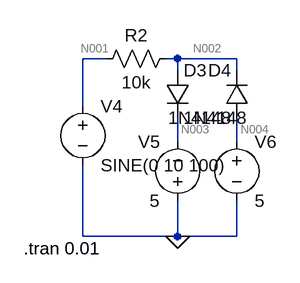
[diagram p0: schematic Draft5.asc]
Draft5.asc, the LTspice schematic file:
Version 4.1
SHEET 1 880 680
WIRE 272 32 240 32
WIRE 368 32 352 32
WIRE 448 32 368 32
WIRE 368 48 368 32
WIRE 448 48 448 32
WIRE 240 96 240 32
WIRE 368 144 368 112
WIRE 448 144 448 112
WIRE 240 272 240 176
WIRE 368 272 368 224
WIRE 368 272 240 272
WIRE 448 272 448 224
WIRE 448 272 368 272
FLAG 368 272 0
SYMBOL voltage 240 80 R0
WINDOW 123 0 0 Left 0
WINDOW 39 0 0 Left 0
SYMATTR InstName V4
SYMATTR Value SINE(0 10 100)
SYMBOL voltage 368 240 R180
WINDOW 0 24 96 Left 2
WINDOW 3 24 16 Left 2
WINDOW 123 0 0 Left 0
WINDOW 39 0 0 Left 0
SYMATTR InstName V5
SYMATTR Value 5
SYMBOL voltage 448 128 R0
WINDOW 123 0 0 Left 0
WINDOW 39 0 0 Left 0
SYMATTR InstName V6
SYMATTR Value 5
SYMBOL res 368 16 R90
WINDOW 0 0 56 VBottom 2
WINDOW 3 32 56 VTop 2
SYMATTR InstName R2
SYMATTR Value 10k
SYMBOL diode 352 48 R0
SYMATTR InstName D3
SYMATTR Value 1N4148
SYMBOL diode 464 112 R180
WINDOW 0 24 64 Left 2
WINDOW 3 24 0 Left 2
SYMATTR InstName D4
SYMATTR Value 1N4148
TEXT 160 288 Left 2 !.tran 0.01

The netlist it stands for:
* Draft5.asc
V4 N001 0 SINE(0 10 100)
V5 0 N003 5
V6 N004 0 5
R2 N002 N001 10k
D3 N002 N003 1N4148
D4 N004 N002 1N4148
.model D D
.lib standard.dio
.tran 0.01
.backanno
.end

* Results of the author's LTspice run, read from the files saved beside the schematic
* Operating Point, zero values left out:
*   V(n003) = -5 V
*   V(n004) = 5 V
*   I(D3) = 7.067 A
*   I(D4) = 7.067 A
*   I(V5) = -7.067 A
*   I(V6) = -7.067 A
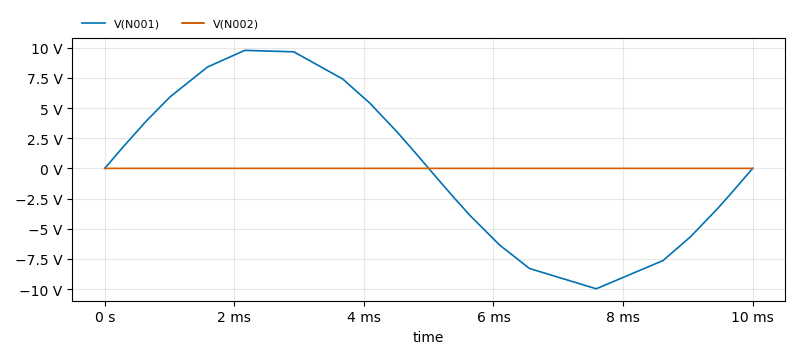
[diagram p1: Transient Analysis of Draft5.asc, plotted from the saved traces]
* Transient Analysis, 1 run:
*   V(N001): min -9.975 V, max 9.774 V, average 34.6 mV, rms 6.967 V, last 0 V
*   V(N002): min -286.5 µV, max 280.7 µV, average 993.7 nV, rms 200.1 µV, last -40.29 pV